# EAGLE board motoretc... (EAGLE 8.0.1), part 1 of 3
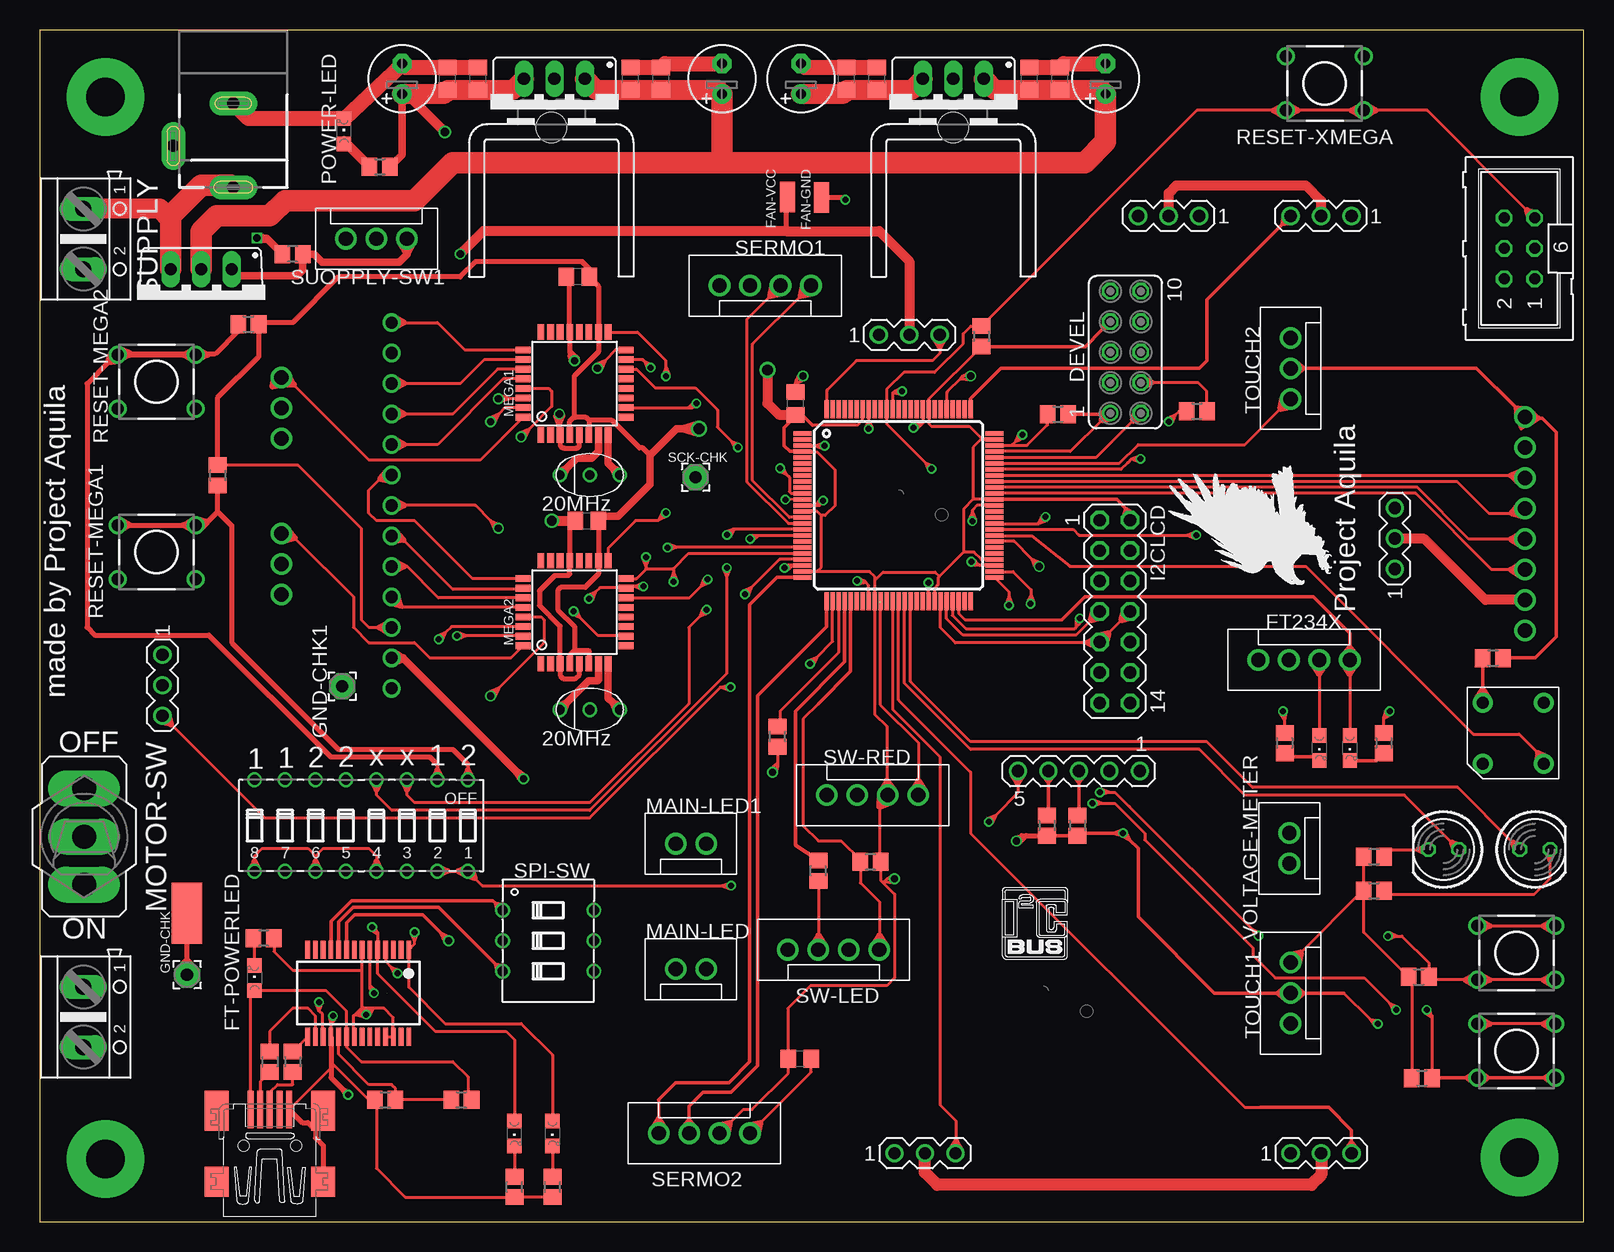
[diagram p5: board, top side]
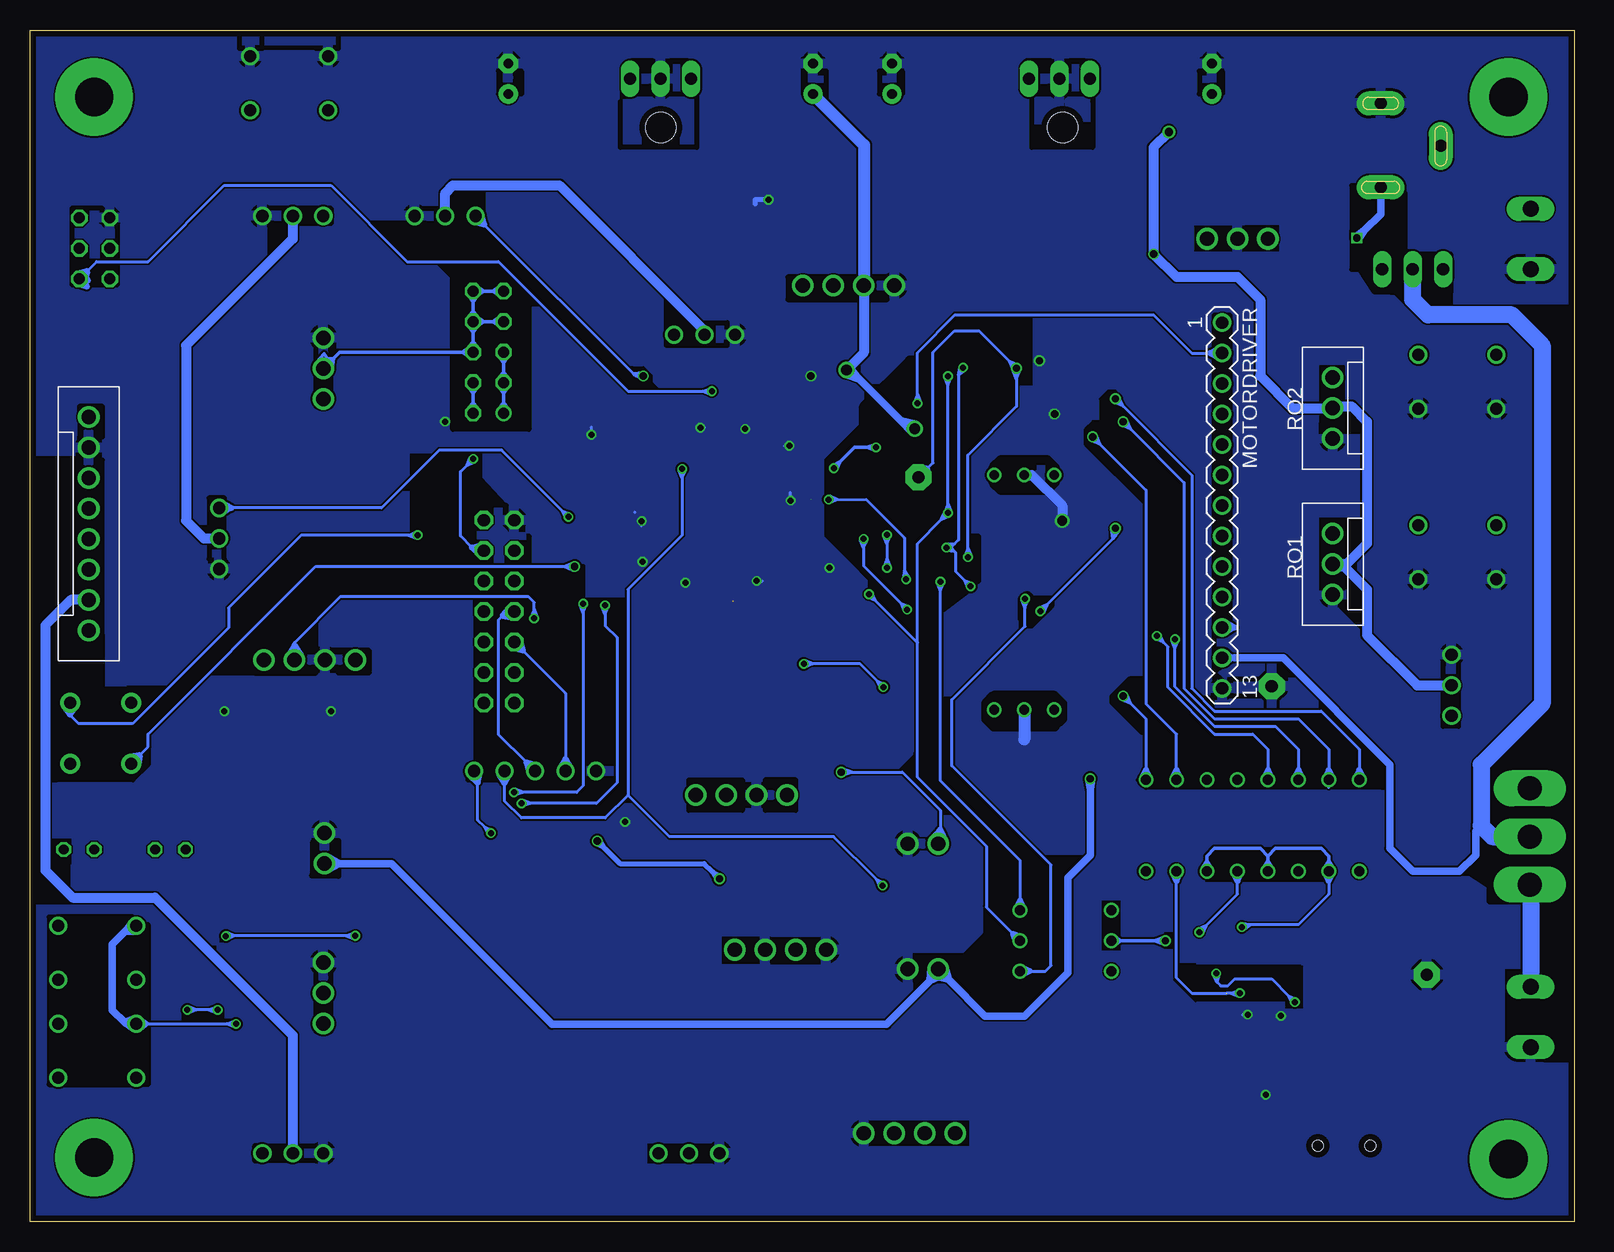
[diagram p6: board, bottom side, seen from below]

Size 128.72 x 99.31 mm. Coordinates in mm from the lower left corner, seen from the top.
Outline: 0,0 128.72,0 128.72,99.31 0,99.31 0,0
Copper layers (1*16): Top 0.035mm / dielectric 1.6mm / Bottom 0.035mm
Design rules "Elecrow_2-layer_PCB_eagle_rule": minimum track width 6mil, minimum drill 12mil, track to track 6mil, track to pad 6mil, pad to pad 6mil, via to via 8mil, smd to smd 0mil, copper to edge 20mil, drill to drill 10mil, minimum pad ring 6mil, minimum via ring 6mil, stop-mask expansion 0mil, vias tented up to drill 100mil, thermal gap 10mil
bRestrict: area 80.1,38.3 to 82.3,48.6; area 82.7,38.4 to 86.8,51.5; area 79.3,48.7 to 86.9,52; area -0.6,14.3 to 4.7,18.5; area -1.2,13.3 to 2.5,14.6; area 4.4,15.1 to 5.7,21.1; area 17.5,50.5 to 18.9,53.1; area 124.5,53.1 to 129.2,63.8; area 122.5,44.9 to 127.9,48.9; area 116.7,43.1 to 120.7,44.7; area 125.3,29.8 to 127.1,31.9; area 125.3,26.5 to 128.6,27; 29 more areas; 232 lines

## Footprints (pad centres in the part's own frame; a part is rotated, then mirrored left to right if it is on the bottom)
E2,5-6 = drill 0.813 pad 1.6: + -1.27,0 | drill 0.813 pad 1.6 octagon: - 1.27,0
C0805 = smd 1.3 x 1.5: 1 -0.95,0; 2 0.95,0
78XXS = drill 1.016 long: GND 0,-2.54; IN -2.54,-2.54; OUT 2.54,-2.54
OSTA71A1D-A = drill 1 pad 1.676: ANODE 2.54,2.54; BLUE 2.54,-2.54; GREEN -2.54,-2.54; RED -2.54,2.54
CON8 = drill 1.2: P$1 -8.89,0; P$2 -6.35,0; P$3 -3.81,0; P$4 -1.27,0; P$5 1.27,0; P$6 3.81,0; P$7 6.35,0; P$8 8.89,0
FE05-2 = drill 0.914: 1 -5.08,1.27 | drill 0.914 octagon: 2 -5.08,-1.27; 3 -2.54,1.27; 4 -2.54,-1.27; 5 0,1.27; 6 0,-1.27; 7 2.54,1.27; 8 2.54,-1.27; 9 5.08,1.27; 10 5.08,-1.27
R0805 = smd 1.3 x 1.5: 1 -0.85,0; 2 0.85,0
SMD1,27-2,54 = smd 1.27 x 2.54: 1 0,0
32005-201 = smd 3.1 x 0.5: 1 3,1.6; 2 3,0.8; 3 3,0; 4 3,-0.8; 5 3,-1.6 | smd 2.5 x 2: M1 -3,-4.45; M2 -3,4.45 | smd 3.3 x 2: M3 2.9,4.45; M4 2.9,-4.45 | hole 0.9: 0,2.2; 0,-2.2
CON4 = drill 1.2: P$1 -3.81,0; P$2 -1.27,0; P$3 1.27,0; P$4 3.81,0
CHIPLED_0805 = smd 1.2 x 1.2: A 0,-1.05; C 0,1.05
2,15/1,0 = drill 1.016 pad 2.159 octagon: 1 0,0
MA07-2 = drill 1.016 octagon: 1 -7.62,-1.27; 2 -7.62,1.27; 3 -5.08,-1.27; 4 -5.08,1.27; 5 -2.54,-1.27; 6 -2.54,1.27; 7 0,-1.27; 8 0,1.27; 9 2.54,-1.27; 10 2.54,1.27; 11 5.08,-1.27; 12 5.08,1.27; 13 7.62,-1.27; 14 7.62,1.27
SSOP28 = smd 0.4 x 1.5: 1 -4.225,-3.625; 2 -3.575,-3.625; 3 -2.925,-3.625; 4 -2.275,-3.625; 5 -1.625,-3.625; 6 -0.975,-3.625; 7 -0.325,-3.625; 8 0.325,-3.625; 9 0.975,-3.625; 10 1.625,-3.625; 11 2.275,-3.625; 12 2.925,-3.625; 13 3.575,-3.625; 14 4.225,-3.625; 15 4.225,3.625; 16 3.575,3.625; 17 2.925,3.625; 18 2.275,3.625; 19 1.625,3.625; 20 0.975,3.625; 21 0.325,3.625; 22 -0.325,3.625; 23 -0.975,3.625; 24 -1.625,3.625; 25 -2.275,3.625; 26 -2.925,3.625; 27 -3.575,3.625; 28 -4.225,3.625
D01PA = hole 2.54: 0,-1.016
LED5MM = drill 0.813 octagon: A -1.27,0; K 1.27,0
MA05-1 = drill 1.016: 1 -5.08,0; 2 -2.54,0; 3 0,0; 4 2.54,0; 5 5.08,0
CON2 = drill 1.2: P$1 -1.27,0; P$2 1.27,0
TQFP32-08 = smd 1.27 x 0.559: 1 -4.293,2.8; 2 -4.293,2; 3 -4.293,1.2; 4 -4.293,0.4; 5 -4.293,-0.4; 6 -4.293,-1.2; 7 -4.293,-2; 8 -4.293,-2.8; 17 4.293,-2.8; 18 4.293,-2; 19 4.293,-1.2; 20 4.293,-0.4; 21 4.293,0.4; 22 4.293,1.2; 23 4.293,2; 24 4.293,2.8 | smd 0.559 x 1.27: 9 -2.8,-4.293; 10 -2,-4.293; 11 -1.2,-4.293; 12 -0.4,-4.293; 13 0.4,-4.293; 14 1.2,-4.293; 15 2,-4.293; 16 2.8,-4.293; 25 2.8,4.293; 26 2,4.293; 27 1.2,4.293; 28 0.4,4.293; 29 -0.4,4.293; 30 -1.2,4.293; 31 -2,4.293; 32 -2.8,4.293
AK500/2 = drill 1.321 long: 1 -2.515,0; 2 2.515,0
320-916 = drill 2.007 long: 1 0,4.013; 2 0,0; 3 0,-4.013
MA13-1 = drill 1.016: 1 -15.24,0; 2 -12.7,0; 3 -10.16,0; 4 -7.62,0; 5 -5.08,0; 6 -2.54,0; 7 0,0; 8 2.54,0; 9 5.08,0; 10 7.62,0; 11 10.16,0; 12 12.7,0; 13 15.24,0
SMD2,54-5,08 = smd 2.54 x 5.08: 1 0,0
CSTLS_X = drill 0.813: 1 -2.5,0; 2 0,0; 3 2.5,0
TO220BV = drill 1.016 long: D 0,-2.54; G -2.54,-2.54; S 2.54,-2.54
DTS-6 = drill 1: 1 -3.25,2.25; 2 3.25,2.25; 3 -3.25,-2.25; 4 3.25,-2.25
CON3 = drill 1.2: P$1 -2.54,0; P$2 0,0; P$3 2.54,0
DIP08S = drill 0.813: 1 -8.89,-3.81; 2 -6.35,-3.81; 3 -3.81,-3.81; 4 -1.27,-3.81; 5 1.27,-3.81; 6 3.81,-3.81; 7 6.35,-3.81; 8 8.89,-3.81; 9 8.89,3.81; 10 6.35,3.81; 11 3.81,3.81; 12 1.27,3.81; 13 -1.27,3.81; 14 -3.81,3.81; 15 -6.35,3.81; 16 -8.89,3.81
DIP03YL = drill 0.813: 1 -2.54,-3.81; 2 0,-3.81; 3 2.54,-3.81; 4 2.54,3.81; 5 0,3.81; 6 -2.54,3.81
MA03-1 = drill 1.016: 1 -2.54,0; 2 0,0; 3 2.54,0
ML6 = drill 0.914 octagon: 1 -2.54,-1.27; 2 -2.54,1.27; 3 0,-1.27; 4 0,1.27; 5 2.54,-1.27; 6 2.54,1.27
TQFP-100A-100 = smd 1.5 x 0.35: 1 -8,6; 2 -8,5.5; 3 -8,5; 4 -8,4.5; 5 -8,4; 6 -8,3.5; 7 -8,3; 8 -8,2.5; 9 -8,2; 10 -8,1.5; 11 -8,1; 12 -8,0.5; 13 -8,0; 14 -8,-0.5; 15 -8,-1; 16 -8,-1.5; 17 -8,-2; 18 -8,-2.5; 19 -8,-3; 20 -8,-3.5; 21 -8,-4; 22 -8,-4.5; 23 -8,-5; 24 -8,-5.5; 25 -8,-6; 51 8,-6; 52 8,-5.5; 53 8,-5; 54 8,-4.5; 55 8,-4; 56 8,-3.5; 57 8,-3; 58 8,-2.5; 59 8,-2; 60 8,-1.5; 61 8,-1; 62 8,-0.5; 63 8,0; 64 8,0.5; 65 8,1; 66 8,1.5; 67 8,2; 68 8,2.5; 69 8,3; 70 8,3.5; 71 8,4; 72 8,4.5; 73 8,5; 74 8,5.5; 75 8,6 | smd 0.35 x 1.5: 26 -6,-8; 27 -5.5,-8; 28 -5,-8; 29 -4.5,-8; 30 -4,-8; 31 -3.5,-8; 32 -3,-8; 33 -2.5,-8; 34 -2,-8; 35 -1.5,-8; 36 -1,-8; 37 -0.5,-8; 38 0,-8; 39 0.5,-8; 40 1,-8; 41 1.5,-8; 42 2,-8; 43 2.5,-8; 44 3,-8; 45 3.5,-8; 46 4,-8; 47 4.5,-8; 48 5,-8; 49 5.5,-8; 50 6,-8; 76 6,8; 77 5.5,8; 78 5,8; 79 4.5,8; 80 4,8; 81 3.5,8; 82 3,8; 83 2.5,8; 84 2,8; 85 1.5,8; 86 1,8; 87 0.5,8; 88 0,8; 89 -0.5,8; 90 -1,8; 91 -1.5,8; 92 -2,8; 93 -2.5,8; 94 -3,8; 95 -3.5,8; 96 -4,8; 97 -4.5,8; 98 -5,8; 99 -5.5,8; 100 -6,8
MJ-179P = drill 1 pad 2 long: 1 3,0; 2 -4,0; 3 -0.45,-5

## Placement (x,y rotation side)
3.3C1  100u  [E2,5-6]  88.85,95.25 90 top
3.3C2  0.1u  [C0805]  85.04,95.25 90 top
3.3C3  0.1u  [C0805]  82.5,95.25 90 top
3.3C4  0.1u  [C0805]  69.8,95.25 90 top
3.3C5  0.1u  [C0805]  67.26,95.25 90 top
3.3C6  100u  [E2,5-6]  63.45,95.25 90 top
3.3V-REGU  [78XXS]  76.15,92.71 180 top
5C11  100u  [E2,5-6]  56.87,95.25 90 top
5C12  0.1u  [C0805]  51.79,95.25 90 top
5C13  0.1u  [C0805]  49.25,95.25 90 top
5C14  0.1u  [C0805]  36.55,95.25 90 top
5C15  0.1u  [C0805]  34.01,95.25 90 top
5C16  100u  [E2,5-6]  30.2,95.25 90 top
5V-REGU  [78XXS]  42.9,92.71 180 top
CHECKLED  OSTA71A1D-A  [OSTA71A1D-A]  122.83,40.72 90 top
CN2  COLOR-XH-M  [CON8]  123.82,58.16 270 bottom
DEVEL  [FE05-2]  90.51,72.47 90 top
DEVEL-R1  4.7K  [R0805]  84.87,67.28 0 top
DEVEL-R2  4.7K  [R0805]  96.46,67.55 0 top
ERROR1-R  330  [R0805]  111.22,27.59 0 top
ERROR2-R  330  [R0805]  111.22,30.43 0 top
FAN-GND  [SMD1,27-2,54]  65.16,85.36 180 top
FAN-VCC  [SMD1,27-2,54]  62.33,85.39 0 top
FT232-R1  4.7K  [R0805]  35.15,10.16 0 top
FT232-R2  10K  [R0805]  28.8,10.16 0 top
FT232-R3  1K  [R0805]  18.67,23.62 180 top
FT232-R4  330  [R0805]  39.56,2.9 90 top
FT232-R5  330  [R0805]  42.74,2.9 90 top
FT232-R6  23  [R0805]  21.08,13.34 270 top
FT232-R7  23  [R0805]  19.18,13.34 270 top
FT232USBCON  Wrie-USB  [32005-201]  19.18,6.35 90 top
FT234-R1  330  [R0805]  103.78,39.9 270 top
FT234-R2  330  [R0805]  112.03,39.9 270 top
FT234X  XH-4  [CON4]  105.39,46.83 180 top
FT-POWERLED  [CHIPLED_0805]  17.91,20.32 0 top
GND-CHK  [2,15/1,0]  12.27,20.59 0 top
GND-CHK1  [2,15/1,0]  25.21,44.62 0 top
I2CLCD  [MA07-2]  89.62,50.85 270 top
IC5  FT232RL  [SSOP28]  26.54,19.05 180 top
KK1  D01PA  [D01PA]  76.15,90.19 180 top
KK2  D01PA  [D01PA]  42.64,90.19 180 top
L1  RXDLED  [CHIPLED_0805]  39.56,7.35 180 top
L2  TXDLED  [CHIPLED_0805]  42.74,7.35 180 top
L3  E1  [LED5MM]  124.64,31.02 0 top
L4  E2  [LED5MM]  117.02,31.02 180 top
LCD-I2C  LCD-I2C  [MA05-1]  86.62,37.56 180 top
LED-R1  330  [R0805]  61.5,40.44 90 top
M1-R1  4.7K  [R0805]  14.84,62.2 90 top
M2-R1  4.7K  [R0805]  17.4,74.8 0 top
M2-R2  4.7K  [R0805]  21.08,80.64 180 top
MAIN-LED  XH-2  [CON2]  54.28,21.05 0 top
MAIN-LED1  XH-2  [CON2]  54.28,31.5 0 top
MEGA1  [TQFP32-08]  44.58,69.85 90 top
MEGA1-C1  0.1u  [C0805]  45.59,58.42 0 top
MEGA2  [TQFP32-08]  44.58,50.8 90 top
MEGA2-C1  0.1u  [C0805]  44.85,78.74 180 top
MOTOR-SUPPLY  MOTOR  [AK500/2]  3.63,17.07 270 top
MOTOR-SW  [320-916]  3.7,32.1 0 top
MOTORDRIVER  [MA13-1]  29.34,59.69 270 bottom
PAD2  [SMD2,54-5,08]  12.29,25.7 0 top
POWER-LED  [CHIPLED_0805]  25.36,90.87 0 top
POWER-LEDR  1K  [R0805]  28.34,87.92 0 top
Q1  20MHz  [CSTLS_X]  45.85,62.23 0 top
Q2  20MHz  [CSTLS_X]  45.85,42.67 0 top
Q3  IRF9530  [TO220BV]  13.46,76.83 180 top
R150  330  [R0805]  121.13,46.98 0 top
RESET-MEGA1  R-1  [DTS-6]  9.73,55.8 0 top
RESET-MEGA2  R-2  [DTS-6]  9.73,70 0 top
RESET-XMEGA  DTS-6  [DTS-6]  107.11,94.86 180 top
RO1  XH-3  [CON3]  20.13,54.8 90 bottom
RO2  XH-3  [CON3]  20.13,67.8 90 bottom
RXD-LED1  RXDLED  [CHIPLED_0805]  109.2,39.48 180 top
S1  [DIP08S]  26.8,33.02 180 top
SCK-CHK  [2,15/1,0]  54.67,62.05 0 top
SERMO  0.1u  [C0805]  63.36,13.57 180 top
SERMO1  XH-4  [CON4]  60.48,78.01 0 top
SERMO2  XH-4  [CON4]  55.4,7.38 180 top
SPI-SW  [DIP03YL]  42.39,23.42 270 top
SUOPPLY-SW1  XH-3  [CON3]  28.07,81.92 180 top
SUPPLY  MAIN  [AK500/2]  3.63,81.9 270 top
SV1  Range1  [MA03-1]  112.95,56.94 90 top
SV2  Range2  [MA03-1]  106.81,83.82 180 top
SV3  [ML6]  123.34,81.11 90 top
SV4  Range3  [MA03-1]  94.11,83.82 180 top
SV5  Range4  [MA03-1]  10.22,44.71 270 top
SV6  Range5  [MA03-1]  73.79,5.71 0 top
SV7  Range6  [MA03-1]  106.81,5.71 0 top
SV8  Servo  [MA03-1]  72.48,73.91 0 top
SW-LED  XH-4  [CON4]  66.17,22.67 0 top
SW-R1  330  [R0805]  64.9,29.26 90 top
SW-R2  4.7K  [R0805]  69.25,29.99 180 top
SW-R3  4.7K  [R0805]  86.49,33.02 270 top
SW-R4  4.7K  [R0805]  83.95,33.02 270 top
SW-RED  XH-4  [CON4]  69.42,35.56 180 top
TESTSW-R1  4.7K  [R0805]  114.94,20.4 0 top
TESTSW-R2  4.7K  [R0805]  115.21,11.97 0 top
TOUCH1  XH-3  [CON3]  104.27,19.05 90 top
TOUCH2  XH-3  [CON3]  104.27,71.12 90 top
TXD-LED1  TXDLED  [CHIPLED_0805]  106.66,39.48 180 top
U1  [TQFP-100A-100]  71.6,59.69 0 top
U$2  [I2C]  80.24,21.86 0 top
U$3  [LOGO]  79.86,17.05 0 top
U$4  [EAGLE-PLC-10MM]  107.7,53.06 90 top
VOLTAGE-METER  XH-2  [CON2]  104.17,31.11 90 top
X1  DCJACK-MJ179P  [MJ-179P]  16.13,89.2 270 top
X-R1  4.7K  [R0805]  78.49,73.79 270 top
XMEGA-C1  0.1u  [C0805]  63.01,68.18 90 top
XMEGA-TEST1  SW1  [DTS-6]  123.1,22.4 0 top
XMEGA-TEST2  SW2  [DTS-6]  123.1,14.24 0 top

## Tracks (layer width: path | path; a pad name or v marks a point on that pad's centre or on a via)
+3V3  (via drill 0.5, 0.6, 0.9)
  Top 0.254: MEGA1-C1.2 arc-90 46.58,58.39 | XMEGA-TEST2.2 125.35,16.49 120.85,16.49 XMEGA-TEST2.1 | XMEGA-TEST1.1 120.85,24.65 125.35,24.65 XMEGA-TEST1.2 | 45.85,78.79 MEGA2-C1.1 45.8,79.42 | M1-R1.2 21.53,63.05 26.8,57.78 26.8,50.16 27.43,49.53 28.32,49.53 MOTORDRIVER.11 | 45.85,65.63 MEGA1.6 | 44.18,47.23 MEGA2.4 | MEGA2.18 46.48,55 | SW-R2.1 70.1,28.45 70.3,28.26 | 70.3,28.26 71.25,27.3 71.25,20.32 70.61,19.68 64.26,19.68 62.36,17.78 62.36,13.62 SERMO.2 62.41,12.39 59.38,9.37 58.65,9.37 57.52,8.23 SERMO2.P$2 | X-R1.2 74.1,68.55 U1.83 74.1,66.51 74.34,66.28 77.49,66.28 78.57,65.19 U1.74 78.46,65.19 77.8,64.53 77.8,60.19 | v71.25,28.57 70.61,28.57 70.38,28.34 | 70.38,28.34 70.3,28.26 | 70.61,29.84 69.98,30.48 69.98,34.6 69.98,34.84 SW-RED.P$2 70.61,35.64 70.61,36.76 70.61,41.27 69.6,42.29 U1.34 69.61,51.7 69.61,53.44 | 70.38,28.34 71.21,28.25 | 71.21,28.25 | 64.41,66.38 68.16,66.38 68.6,66.82 U1.94 | U1.54 78.5,55.19 77.88,55.8 77,55.8 | 77,55.8 74.98,53.79 | 74.98,53.79 74.89,53.7 74.89,53.07 74.6,52.77 U1.44 | U1.64 77.8,60.19 | 77.8,60.19 77,59.39 77,55.8 | 69.61,53.44 70.3,54.13 74.64,54.13 74.98,53.79 | 69.61,53.44 69.61,53.75 69.18,54.18 63.61,54.18 U1.24 64.78,54.19 65.14,54.55 65.14,58.83 | 65.14,58.83 64.79,59.19 U1.14 | U1.4 63.62,64.17 64.8,64.17 | 64.8,64.17 66.29,62.67 66.29,59.68 65.47,58.86 65.14,58.86 65.14,58.83 | 64.8,64.17 64.79,64.16 | 63.01,67.12 XMEGA-C1.1 | v111.54,16.49 111.27,16.49 110.89,16.87 | 110.89,16.87 108.71,19.05 | 70.38,28.34 | 70.38,28.34 71.21,28.25 | v71.25,28.57 71.21,28.25 | 70.38,28.34 71.05,28.84 | v71.25,28.57 71.05,28.84 | 71.21,28.25 | 70.38,28.34 71.21,28.25
  Top 0.254: v71.25,28.57 71.21,28.25 | 70.38,28.34 71.05,28.84 v71.25,28.57 | 70.38,28.34 71.21,28.25 | 70.38,28.34 71.05,28.84 | 70.38,28.34 71.21,28.25 | v71.25,28.57 71.21,28.25 | 70.38,28.34 71.05,28.84 | v71.25,28.57 71.05,28.84 | 110.89,16.87 111.33,16.32 v111.54,16.49 | 110.89,16.87 111.58,16.76 v111.54,16.49
  Top 0.305: 108.71,19.05 105.47,19.05 | 105.47,19.05 | 105.47,19.05 TOUCH1.P$2 | 70.61,29.84 70.24,29.84 SW-R2.1 | TOUCH2.P$2 105.47,71.12 | 105.47,71.12 | 105.47,71.12 119.76,71.12 122.98,67.9 | 122.98,67.9 | 122.98,67.9 CN2.P$1 | v90.3,32.38 89.55,32.38 | 89.55,32.38 86.7,32.38 SW-R3.2 SW-R4.2 | DEVEL.7 88.59,74.36 | 88.59,74.36 87.17,72.94 X-R1.2 | I2CLCD.2 90.93,58.52 90.93,59.05 90.56,59.43 | 90.56,59.43 89.8,60.19 U1.64 | TOUCH1.P$2 103.07,19.05 | 103.07,19.05 | 103.07,19.05 97.92,19.05 91.57,25.4 91.57,31.11 90.83,31.86 | 90.83,31.86 v90.3,32.38 | 122.98,67.9 | 122.98,67.9 123.91,67.8 | 18.38,74.93 M2-R1.2 | 105.47,71.12 104.73,71.7 | 103.07,19.05 | 103.07,19.05 103.8,19.64 | 105.47,19.05 104.73,19.64 | 103.07,19.05 103.8,19.64 | 122.98,67.9 123.08,66.97 | 123.08,66.97 | 122.98,67.9 | 123.08,66.97 125.02,66.97 | 125.02,66.97 125.23,66.97 126.43,65.77 126.43,48.77 124.64,46.98 R150.2 | 63.01,67.12 62.05,66.16 62.05,64.67 62.52,64.19 U1.4 | 64.41,66.38 63.55,67.23 | 89.55,32.38 90.21,32.15 v90.3,32.38 | 89.55,32.38 90.21,32.62 v90.3,32.38 | 90.83,31.86 90.52,32.49 v90.3,32.38 | 90.83,31.86 90.19,32.16 v90.3,32.38 | 105.47,71.12 | 105.47,71.12 104.73,71.7 | 105.47,71.12 | 105.47,71.12 104.73,70.53 | 105.47,71.12 104.73,71.7 | 104.73,71.7 | TOUCH2.P$2 104.73,71.7 | 105.47,71.12 104.73,70.53 | 105.47,71.12 104.73,71.7 | TOUCH2.P$2 104.73,71.7 | 105.47,71.12 104.73,70.53 | 104.73,70.53 | 104.73,70.53 | TOUCH2.P$2 104.73,70.53 | 105.47,71.12 104.73,71.7 | 105.47,71.12 104.73,70.53 | 105.47,71.12 104.73,71.7 | 105.47,71.12 | 105.47,71.12 104.73,70.53 | TOUCH2.P$2 104.73,70.53 | 105.47,71.12 104.73,71.7 | TOUCH2.P$2 104.73,71.7 | 105.47,71.12 104.73,70.53 | TOUCH2.P$2 104.73,70.53
  Top 0.305: 105.47,19.05 | 105.47,19.05 104.73,19.64 | 105.47,19.05 | 105.47,19.05 104.73,18.46 | 105.47,19.05 104.73,19.64 | 104.73,19.64 | TOUCH1.P$2 104.73,19.64 | 105.47,19.05 104.73,18.46 | 103.07,19.05 103.8,18.46 | 103.07,19.05 103.8,19.64 | 103.8,19.64 | TOUCH1.P$2 103.8,19.64 | 103.8,18.46 | 105.47,19.05 104.73,19.64 | TOUCH1.P$2 104.73,19.64 | 105.47,19.05 104.73,18.46 | 104.73,18.46 | 104.73,18.46 | TOUCH1.P$2 104.73,18.46 | 105.47,19.05 104.73,19.64 | 105.47,19.05 104.73,18.46 | 105.47,19.05 104.73,19.64 | 105.47,19.05 | 105.47,19.05 104.73,18.46 | TOUCH1.P$2 104.73,18.46 | 105.47,19.05 104.73,19.64 | TOUCH1.P$2 104.73,19.64 | 105.47,19.05 104.73,18.46 | TOUCH1.P$2 104.73,18.46 | 103.07,19.05 | 103.07,19.05 103.8,18.46 | 103.07,19.05 103.8,19.64 | 103.07,19.05 | 103.07,19.05 103.8,18.46 | TOUCH1.P$2 103.8,18.46 | 103.07,19.05 103.8,19.64 | 103.07,19.05 103.8,18.46 | 103.8,18.46 | TOUCH1.P$2 103.8,18.46 | 103.07,19.05 103.8,19.64 | TOUCH1.P$2 103.8,19.64 | 103.07,19.05 103.8,18.46 | TOUCH1.P$2 103.8,18.46 | 103.07,19.05 103.8,19.64 | TOUCH1.P$2 103.8,19.64 | CN2.P$1 124.3,66.61 123.51,66.09 123.18,66.97 CN2.P$1 | 122.98,67.9 123.08,66.97 | CN2.P$1 123.08,66.97 | 122.98,67.9 123.91,67.8 | 123.91,67.8 | CN2.P$1 123.91,67.8 | 122.98,67.9 123.08,66.97 | CN2.P$1 123.08,66.97 | 122.98,67.9 123.91,67.8 | CN2.P$1 123.91,67.8 | 125.02,66.97 124.33,67.61 CN2.P$1 | 125.02,66.97 124.25,66.44 CN2.P$1 | 90.56,59.43 90.31,58.66 I2CLCD.2 | 90.56,59.43 91.23,58.98 I2CLCD.2 | 88.59,74.36 | 88.59,74.36 89.32,74.48 | 89.32,74.48 | 88.59,74.36 | 88.59,74.36 88.71,75.1 | 88.71,75.1 | 88.59,74.36 89.32,74.48 | 88.59,74.36 88.71,75.1 | 88.59,74.36 89.32,74.48 | DEVEL.7 89.32,74.48 | 88.59,74.36 88.71,75.1
  Top 0.305: DEVEL.7 88.71,75.1
  Top 0.406: MEGA2-C1.1 46.58,77.96 MEGA1.18 46.58,72.48 44.58,70.48 44.58,67.11 | 46.58,58.39 MEGA2.18 46.58,53.99 45.47,52.88 43.43,52.88 43.17,52.62 43.17,51.02 44.58,49.62 44.58,47.62 | 44.58,47.62 44.18,47.23 | 63.55,67.23 XMEGA-C1.1 | M1-R1.2 14.84,68.69 18.25,72.1 M2-R1.2 | 18.38,74.93 21.08,74.93 24.89,78.74 35.05,78.74 36.32,80.01 45.21,80.01 45.8,79.42 | v81.42,31.73 81.86,32.17 82.2,32.17 | 82.2,32.17 SW-R4.2 | MEGA2.6 45.78,47.58 45.73,47.62 44.58,47.62 | MEGA1.4 44.18,66.71 44.58,67.11 | 45.78,66.79 MEGA1.6 | 45.78,66.79 45.53,67.04 44.65,67.04 44.58,67.11 | 50.88,63.87 50.25,64.5 49.99,64.5 47.7,66.79 45.78,66.79 | 82.2,32.17 81.36,31.97 v81.42,31.73 | 82.2,32.17 81.6,31.56 v81.42,31.73
  Top 0.508: 29.08,49.97 | 120.09,25.08 | 120.09,16.92 | 28.32,49.53 | 28.32,49.53 | 28.32,49.53 | 29.08,49.09 | 29.08,49.09 | 28.32,49.53 29.08,49.09 | MOTORDRIVER.11 29.08,49.09 | 28.32,49.53 29.08,49.97 | 29.08,49.97 | 29.08,49.97 | MOTORDRIVER.11 29.08,49.97 | 120.85,24.65 | 120.85,24.65 120.09,25.08 | 120.85,24.65 | 120.85,24.65 120.09,25.08 | 120.09,25.08 | XMEGA-TEST1.1 120.09,25.08 | 120.85,24.65 120.09,24.22 | 120.85,16.49 | 120.85,16.49 120.09,16.92 | 120.85,16.49 | 120.85,16.49 120.09,16.92 | 120.09,16.92 | XMEGA-TEST2.1 120.09,16.92 | 120.85,16.49 120.09,16.06 | 125.35,16.49 | 125.35,16.49 126.1,16.92 | 125.35,16.49 126.1,16.06 | 125.35,16.49 126.1,16.92 | 126.1,16.92 | XMEGA-TEST2.2 126.1,16.92 | 125.35,24.65 | 125.35,24.65 126.1,25.08 | 125.35,24.65 126.1,24.22 | 125.35,24.65 126.1,25.08 | 126.1,25.08 | XMEGA-TEST1.2 126.1,25.08 | 28.32,49.53 29.08,49.09 | 29.08,49.09 | 29.08,49.09 | 28.32,49.53 | 28.32,49.53 29.08,49.09 | MOTORDRIVER.11 29.08,49.09 | 28.32,49.53 29.08,49.97 | 29.08,49.97 | MOTORDRIVER.11 29.08,49.97 | 28.32,49.53 | 28.32,49.53 29.08,49.09 | MOTORDRIVER.11 29.08,49.09 | 28.32,49.53 29.08,49.97 | MOTORDRIVER.11 29.08,49.97 | 28.32,49.53 29.08,49.09 | 28.32,49.53 29.08,49.97 | 28.32,49.53 29.08,49.09 | MOTORDRIVER.11 29.08,49.09 | 28.32,49.53 29.08,49.97 | MOTORDRIVER.11 29.08,49.97 | SW-RED.P$2 70.92,34.96 69.98,34.6 70.05,35.6 SW-RED.P$2 | SW-RED.P$2 70.13,35.87 70.61,36.76 71.21,35.94 SW-RED.P$2 | 120.85,24.65 120.09,25.08 | 120.09,25.08 | 120.09,24.22 | 120.85,24.65 120.09,25.08 | 120.09,25.08 | 120.85,24.65 | 120.09,24.22 | XMEGA-TEST1.1 120.09,24.22 | 120.85,24.65 120.09,25.08 | 120.09,25.08 | 120.85,24.65 | 120.85,24.65 120.09,24.22 | XMEGA-TEST1.1 120.09,24.22 | 120.85,24.65 120.09,25.08
  Top 0.508: XMEGA-TEST1.1 120.09,25.08 | 120.85,24.65 120.09,24.22 | XMEGA-TEST1.1 120.09,24.22 | 120.85,16.49 120.09,16.92 | 120.09,16.92 | 120.09,16.06 | 120.85,16.49 120.09,16.92 | 120.09,16.92 | 120.85,16.49 | 120.09,16.06 | XMEGA-TEST2.1 120.09,16.06 | 120.85,16.49 120.09,16.92 | 120.09,16.92 | 120.85,16.49 | 120.85,16.49 120.09,16.06 | XMEGA-TEST2.1 120.09,16.06 | 120.85,16.49 120.09,16.92 | XMEGA-TEST2.1 120.09,16.92 | 120.85,16.49 120.09,16.06 | XMEGA-TEST2.1 120.09,16.06 | 125.35,16.49 126.1,16.06 | 126.1,16.06 | 125.35,16.49 126.1,16.06 | 126.1,16.06 | 125.35,16.49 | 125.35,16.49 126.1,16.06 | XMEGA-TEST2.2 126.1,16.06 | 125.35,16.49 126.1,16.92 | 126.1,16.92 | 126.1,16.92 | 125.35,16.49 | 125.35,16.49 126.1,16.06 | XMEGA-TEST2.2 126.1,16.06 | 125.35,16.49 | 125.35,16.49 126.1,16.92 | 126.1,16.92 | 125.35,16.49 126.1,16.06 | 125.35,16.49 126.1,16.92 | 125.35,16.49 126.1,16.06 | XMEGA-TEST2.2 126.1,16.06 | 125.35,16.49 126.1,16.92 | XMEGA-TEST2.2 126.1,16.92 | 125.35,24.65 126.1,24.22 | 126.1,24.22 | 125.35,24.65 126.1,24.22 | 126.1,24.22 | 125.35,24.65 | 125.35,24.65 126.1,24.22 | XMEGA-TEST1.2 126.1,24.22 | 125.35,24.65 126.1,25.08 | 126.1,25.08 | 126.1,25.08 | 125.35,24.65 | 125.35,24.65 126.1,24.22 | XMEGA-TEST1.2 126.1,24.22 | 125.35,24.65 | 125.35,24.65 126.1,25.08 | 126.1,25.08 | 125.35,24.65 126.1,24.22 | 125.35,24.65 126.1,25.08 | 125.35,24.65 126.1,24.22 | XMEGA-TEST1.2 126.1,24.22 | 125.35,24.65 126.1,25.08 | XMEGA-TEST1.2 126.1,25.08 | 57.52,8.23 56.53,8.01 SERMO2.P$2 57.3,7.24 57.52,8.23
  Top 0.61: MEGA1-C1.2 46.9,58.78 48.21,58.78 50.88,61.44 50.88,63.87 53.09,66.08 53.61,66.08 | v54.96,66.08 53.61,66.08 | 53.61,66.08 54.86,65.73 v54.96,66.08 | 53.61,66.08 54.86,66.44 v54.96,66.08
  Top 0.813: v60.66,70.99 60.66,68.2 61.6,67.26 62.98,67.26 XMEGA-C1.1
  Top 1.676: 3.3V-REGU.OUT 72.66,94.3 3.3C4.1 3.3C5.1 66.94,93.98 3.3C6.+
  Bottom 0.254: 28.32,49.53 MOTORDRIVER.11 | v90.3,32.38 90.83,32.91 | 90.83,32.91 91.39,33.47 91.39,36.59 91.39,36.96 91.7,37.27 LCD-I2C.1 | 118.85,16.51 112.29,16.51 | 112.29,16.51 111.56,16.51 v111.54,16.49 | 59.21,77.44 SERMO1.P$2 | 90.83,32.91 90.19,32.64 v90.3,32.38 | 90.83,32.91 90.55,32.27 v90.3,32.38 | 112.29,16.51 111.64,16.75 v111.54,16.49 | 112.29,16.51 111.65,16.24 v111.54,16.49
  Bottom 0.305: XMEGA-TEST2.1 119.83,16.51 118.85,16.51 | DEVEL.6 92.69,72.47 | 92.69,72.47 | 92.69,72.47 102.92,72.47 103.42,71.97 | 103.42,71.97 | 103.42,71.97 TOUCH2.P$2 | DEVEL.9 90.15,77.55 | 90.15,77.55 | 90.15,77.55 90.86,77.55 | 90.86,77.55 | 90.86,77.55 DEVEL.10 | DEVEL.10 91.78,76.64 | 91.78,76.64 | 91.78,76.64 91.78,75.92 | 91.78,75.92 | 91.78,75.92 DEVEL.8 | DEVEL.8 91.78,74.1 | 91.78,74.1 | 91.78,74.1 91.78,73.38 | 91.78,73.38 | 91.78,73.38 DEVEL.6 | DEVEL.7 90.15,75.01 | 90.15,75.01 | 90.15,75.01 90.86,75.01 | 90.86,75.01 | 90.86,75.01 DEVEL.8 | 103.42,71.97 | 103.42,71.97 104.35,71.86 | 91.78,73.38 91.35,72.78 | 91.78,75.92 91.35,75.32 | 90.86,75.01 91.47,74.58 | 90.86,77.55 91.47,77.12 | 90.15,77.55 89.55,77.12 | 91.78,73.38 | 91.78,73.38 92.21,72.78 | 92.69,72.47 92.09,72.04 | 91.78,73.38 91.35,72.78 | 91.35,72.78 | 103.42,71.97 103.52,71.04 | 103.52,71.04 | 103.42,71.97 | 90.86,75.01 91.47,74.58 | 91.47,74.58 | 91.78,75.92 | 91.78,75.92 92.21,75.32 | 90.86,75.01 | 90.86,75.01 91.47,75.44 | 91.78,75.92 91.35,75.32 | 91.35,75.32 | 91.78,74.1 91.35,74.7 | 90.86,77.55 91.47,77.12 | 91.47,77.12 | 90.86,77.55 | 90.86,77.55 91.47,77.98 | 91.78,76.64 91.35,77.24 | 90.15,75.01 89.55,74.58 | 90.15,77.55 89.55,77.98 | 90.15,77.55 | 90.15,77.55 89.55,77.98 | 89.55,77.98 | 90.15,77.55 | 90.15,77.55 89.55,77.98 | 89.55,77.98 | DEVEL.9 89.55,77.98 | 90.15,77.55 89.55,77.12 | 90.15,77.55 89.55,77.98 | DEVEL.9 89.55,77.98 | 90.15,77.55 89.55,77.12 | 89.55,77.12 | DEVEL.9 89.55,77.12 | 90.15,77.55 89.55,77.98 | DEVEL.9 89.55,77.98 | 90.15,77.55 89.55,77.12 | DEVEL.9 89.55,77.12 | 90.15,77.55 89.55,77.98 | 90.15,77.55 | 90.15,77.55 89.55,77.12 | DEVEL.9 89.55,77.12 | 90.15,77.55 89.55,77.98 | DEVEL.9 89.55,77.98 | 90.15,77.55 89.55,77.12
  Bottom 0.305: DEVEL.9 89.55,77.12 | 92.69,72.47 92.09,72.9 | 91.78,73.38 92.21,72.78 | 92.69,72.47 | 92.69,72.47 92.09,72.9 | 92.09,72.9 | 92.69,72.47 | 92.69,72.47 92.09,72.9 | 92.09,72.9 | DEVEL.6 92.09,72.9 | 92.69,72.47 92.09,72.04 | 91.78,73.38 91.35,72.78 | 91.78,73.38 92.21,72.78 | 92.21,72.78 | DEVEL.6 92.21,72.78 | 91.35,72.78 | 92.69,72.47 92.09,72.9 | DEVEL.6 92.09,72.9 | 92.69,72.47 92.09,72.04 | 92.09,72.04 | DEVEL.6 92.09,72.04 | 92.69,72.47 92.09,72.9 | DEVEL.6 92.09,72.9 | 92.69,72.47 92.09,72.04 | DEVEL.6 92.09,72.04 | 92.69,72.47 92.09,72.9 | 92.69,72.47 | 92.69,72.47 92.09,72.04 | DEVEL.6 92.09,72.04 | 92.69,72.47 92.09,72.9 | DEVEL.6 92.09,72.9 | 92.69,72.47 92.09,72.04 | DEVEL.6 92.09,72.04 | 91.78,73.38 | 91.78,73.38 91.35,72.78 | DEVEL.6 91.35,72.78 | 91.78,73.38 92.21,72.78 | 91.78,73.38 | 91.78,73.38 91.35,72.78 | DEVEL.6 91.35,72.78 | 91.78,73.38 92.21,72.78 | 92.21,72.78 | 91.78,73.38 91.35,72.78 | DEVEL.6 91.35,72.78 | 91.78,73.38 92.21,72.78 | DEVEL.6 92.21,72.78 | 91.78,73.38 91.35,72.78 | DEVEL.6 91.35,72.78 | 91.78,73.38 92.21,72.78 | DEVEL.6 92.21,72.78 | 103.42,71.97 103.52,71.04 | TOUCH2.P$2 103.52,71.04 | 103.42,71.97 104.35,71.86 | 104.35,71.86 | TOUCH2.P$2 104.35,71.86 | TOUCH2.P$2 103.65,71.55 104.19,72.32 104.82,71.62 TOUCH2.P$2 | 103.42,71.97 103.52,71.04 | TOUCH2.P$2 103.52,71.04 | 103.42,71.97 104.35,71.86 | TOUCH2.P$2 104.35,71.86 | 118.85,16.51 119.48,16.02 XMEGA-TEST2.1 | 118.85,16.51 119.5,16.98 XMEGA-TEST2.1 | 91.78,75.92 92.21,75.32 | 91.78,74.1 91.35,74.7 | 90.86,75.01 91.47,74.58 | 91.78,75.92 91.35,75.32 | 91.78,75.92 92.21,75.32 | 92.21,75.32 | DEVEL.8 92.21,75.32 | 91.35,75.32 | 91.78,74.1 | 91.78,74.1 92.21,74.7 | 92.21,74.7 | 91.78,74.1 | 91.78,74.1 92.21,74.7
  Bottom 0.305: 92.21,74.7 | DEVEL.8 92.21,74.7 | 91.78,74.1 91.35,74.7 | 90.86,75.01 91.47,74.58 | 90.86,75.01 91.47,75.44 | 91.47,75.44 | DEVEL.8 91.47,75.44 | 91.47,74.58 | 91.78,75.92 | 91.78,75.92 91.35,75.32 | DEVEL.8 91.35,75.32 | 91.78,75.92 92.21,75.32 | 91.78,75.92 | 91.78,75.92 91.35,75.32 | DEVEL.8 91.35,75.32 | 91.78,75.92 92.21,75.32 | 92.21,75.32 | 91.78,75.92 91.35,75.32 | DEVEL.8 91.35,75.32 | 91.78,75.92 92.21,75.32 | DEVEL.8 92.21,75.32 | 91.78,75.92 91.35,75.32 | DEVEL.8 91.35,75.32 | 91.78,75.92 92.21,75.32 | DEVEL.8 92.21,75.32 | 91.78,74.1 92.21,74.7 | DEVEL.8 92.21,74.7 | 91.78,74.1 91.35,74.7 | 91.35,74.7 | DEVEL.8 91.35,74.7 | 91.78,74.1 92.21,74.7 | DEVEL.8 92.21,74.7 | 91.78,74.1 91.35,74.7 | DEVEL.8 91.35,74.7 | 91.78,74.1 92.21,74.7 | 91.78,74.1 | 91.78,74.1 91.35,74.7 | DEVEL.8 91.35,74.7 | 91.78,74.1 92.21,74.7 | DEVEL.8 92.21,74.7 | 91.78,74.1 91.35,74.7 | DEVEL.8 91.35,74.7 | 90.86,75.01 | 90.86,75.01 91.47,74.58 | DEVEL.8 91.47,74.58 | 90.86,75.01 91.47,75.44 | 90.86,75.01 | 90.86,75.01 91.47,74.58 | DEVEL.8 91.47,74.58 | 90.86,75.01 91.47,75.44 | 91.47,75.44 | 90.86,75.01 91.47,74.58 | DEVEL.8 91.47,74.58 | 90.86,75.01 91.47,75.44 | DEVEL.8 91.47,75.44 | 90.86,75.01 91.47,74.58 | DEVEL.8 91.47,74.58 | 90.86,75.01 91.47,75.44 | DEVEL.8 91.47,75.44 | 90.86,77.55 91.47,77.12 | 91.78,76.64 91.35,77.24 | 90.86,77.55 91.47,77.12 | 90.86,77.55 91.47,77.98 | 91.47,77.98 | DEVEL.10 91.47,77.98 | 91.47,77.12 | 91.78,76.64 | 91.78,76.64 92.21,77.24 | 92.21,77.24 | 91.78,76.64 | 91.78,76.64 92.21,77.24 | 92.21,77.24 | DEVEL.10 92.21,77.24 | 91.78,76.64 91.35,77.24 | 90.86,77.55 | 90.86,77.55 91.47,77.12 | DEVEL.10 91.47,77.12 | 90.86,77.55 91.47,77.98 | 90.86,77.55 | 90.86,77.55 91.47,77.12 | DEVEL.10 91.47,77.12
  Bottom 0.305: 90.86,77.55 91.47,77.98 | 91.47,77.98 | 90.86,77.55 91.47,77.12 | DEVEL.10 91.47,77.12 | 90.86,77.55 91.47,77.98 | DEVEL.10 91.47,77.98 | 90.86,77.55 91.47,77.12 | DEVEL.10 91.47,77.12 | 90.86,77.55 91.47,77.98 | DEVEL.10 91.47,77.98 | 91.78,76.64 92.21,77.24 | DEVEL.10 92.21,77.24 | 91.78,76.64 91.35,77.24 | 91.35,77.24 | DEVEL.10 91.35,77.24 | 91.78,76.64 92.21,77.24 | DEVEL.10 92.21,77.24 | 91.78,76.64 91.35,77.24 | DEVEL.10 91.35,77.24 | 91.78,76.64 92.21,77.24 | 91.78,76.64 | 91.78,76.64 91.35,77.24 | DEVEL.10 91.35,77.24 | 91.78,76.64 92.21,77.24 | DEVEL.10 92.21,77.24 | 91.78,76.64 91.35,77.24 | DEVEL.10 91.35,77.24 | 90.15,75.01 89.55,75.44 | 90.15,75.01 | 90.15,75.01 89.55,75.44 | 89.55,75.44 | 90.15,75.01 | 90.15,75.01 89.55,75.44 | 89.55,75.44 | DEVEL.7 89.55,75.44 | 90.15,75.01 89.55,74.58 | 90.15,75.01 89.55,75.44 | DEVEL.7 89.55,75.44 | 90.15,75.01 89.55,74.58 | 89.55,74.58 | DEVEL.7 89.55,74.58 | 90.15,75.01 89.55,75.44 | DEVEL.7 89.55,75.44 | 90.15,75.01 89.55,74.58 | DEVEL.7 89.55,74.58 | 90.15,75.01 89.55,75.44 | 90.15,75.01 | 90.15,75.01 89.55,74.58 | DEVEL.7 89.55,74.58 | 90.15,75.01 89.55,75.44 | DEVEL.7 89.55,75.44 | 90.15,75.01 89.55,74.58 | DEVEL.7 89.55,74.58
  Bottom 0.406: 71.88,29.21 72.52,29.84 79.53,29.84 80.78,31.09 | 71.88,29.21 v71.25,28.57 | 80.78,31.09 v81.42,31.73 | 71.88,29.21 71.13,28.79 v71.25,28.57 | 71.88,29.21 71.46,28.45 v71.25,28.57 | 80.78,31.09 81.54,31.51 v81.42,31.73 | 80.78,31.09 81.2,31.85 v81.42,31.73
  Bottom 0.508: 29.08,49.97 | 28.32,49.53 | 28.32,49.53 | 28.32,49.53 | 29.08,49.09 | 29.08,49.09 | 28.32,49.53 29.08,49.09 | MOTORDRIVER.11 29.08,49.09 | 28.32,49.53 29.08,49.97 | 29.08,49.97 | 29.08,49.97 | MOTORDRIVER.11 29.08,49.97 | 28.32,49.53 29.08,49.09 | 29.08,49.09 | 29.08,49.09 | 28.32,49.53 | 28.32,49.53 29.08,49.09 | MOTORDRIVER.11 29.08,49.09 | 28.32,49.53 29.08,49.97 | 29.08,49.97 | MOTORDRIVER.11 29.08,49.97 | 28.32,49.53 | 28.32,49.53 29.08,49.09 | MOTORDRIVER.11 29.08,49.09 | 28.32,49.53 29.08,49.97 | MOTORDRIVER.11 29.08,49.97 | 28.32,49.53 29.08,49.09 | 28.32,49.53 29.08,49.97 | 28.32,49.53 29.08,49.09 | MOTORDRIVER.11 29.08,49.09 | 28.32,49.53 29.08,49.97 | MOTORDRIVER.11 29.08,49.97 | 91.39,36.59 92.04,37.18 LCD-I2C.1 91.2,37.45 91.39,36.59
  Bottom 0.61: 120.75,24.22 120.09,24.22 120.09,24.4 XMEGA-TEST1.1 | 120.75,24.22 120.77,24.22 121.84,23.15 121.84,17.65 120.84,16.64 | 120.84,16.64 120.74,16.55 119.91,16.55 XMEGA-TEST2.1 | v60.66,70.99 60.34,70.99 59.56,70.2 | 59.56,70.2 56.12,66.77 | 56.12,66.77 55.56,66.2 55.08,66.2 v54.96,66.08 | 59.56,70.2 60.79,70.64 v60.66,70.99 | 59.56,70.2 60.37,71.22 v60.66,70.99 | 56.12,66.77 54.87,66.44 v54.96,66.08 | 56.12,66.77 55.23,65.83 v54.96,66.08 | 120.75,24.22 120.2,24.92 XMEGA-TEST1.1 | 120.75,24.22 119.85,24.2 XMEGA-TEST1.1 | 120.84,16.64 | 120.84,16.64 119.98,16.91 | XMEGA-TEST2.1 119.98,16.91 | 120.84,16.64 | 120.84,16.64 120.1,16.12 | XMEGA-TEST2.1 120.1,16.12 | 120.84,16.64 119.98,16.91 | 120.84,16.64 120.1,16.12 | 120.84,16.64 119.98,16.91 | XMEGA-TEST2.1 119.98,16.91 | 120.84,16.64 120.1,16.12 | XMEGA-TEST2.1 120.1,16.12
  Bottom 0.813: SERMO1.P$2 59.21,72.42 60.5,71.13 60.52,71.13 v60.66,70.99
  Bottom 1.016: 3.3C6.+ 59.18,89.72 59.21,89.69 SERMO1.P$2
+5V  (via drill 0.6, 0.7)
  Top 0.406: FAN-VCC.1 62.19,85.39 62.19,82.55
  Top 0.61: 5C16.+ 30.2,93.17 | 30.2,93.17 | 30.2,93.17 30.2,88.92 POWER-LEDR.2 | 30.2,93.17 29.8,93.68 | 30.2,93.17 | 30.2,93.17 30.59,93.68 | 30.2,93.17 | 30.2,93.17 29.8,93.68 | 29.8,93.68 | 30.2,93.17 30.59,93.68 | 30.2,93.17 29.8,93.68 | 5C16.+ 29.8,93.68 | 30.2,93.17 30.59,93.68 | 30.59,93.68 | 30.2,93.17 30.59,93.68 | 5C16.+ 30.59,93.68 | 30.2,93.17 29.8,93.68 | 29.8,93.68 | 29.8,93.68 | 5C16.+ 29.8,93.68 | 30.2,93.17 30.59,93.68 | 30.2,93.17 29.8,93.68 | 30.2,93.17 30.59,93.68 | 5C16.+ 30.59,93.68 | 30.2,93.17 | 30.2,93.17 29.8,93.68 | 5C16.+ 29.8,93.68 | 30.2,93.17 30.59,93.68 | 5C16.+ 30.59,93.68 | 30.2,93.17 29.8,93.68 | 5C16.+ 29.8,93.68
  Top 0.813: v35.05,80.64 36.96,82.55 62.19,82.55 69.98,82.55 72.48,80.04 SV8.2 | SV4.2 94.11,85.72 94.74,86.36 105.54,86.36 106.81,85.09 SV2.2 | 5C16.+ 30.61,93.98 v33.78,90.81 | CN2.P$7 120.5,51.81 115.41,56.91 112.99,56.91 SV1.2
  Top 1.016: SV7.2 106.81,3.88 106,3.07 74.83,3.07 73.77,4.12 73.77,5.7 SV6.2
  Top 1.676: 5V-REGU.OUT 39.41,94.3 5C14.1 5C15.1 33.69,93.98 5C16.+
  Bottom 0.813: RO2.P$2 20.27,67.94 | 30.61,93.98 5C16.+ | RO2.P$2 19.98,67.94 18.54,67.94 17.27,66.67 17.27,56.52 18.99,54.8 RO1.P$2 19.94,54.61 19.18,54.61 17.27,52.7 17.27,48.9 13.08,44.71 SV5.2 | RO2.P$2 23.48,67.8 26.16,70.48 26.16,76.83 28.07,78.74 33.15,78.74 v35.05,80.64 35.05,89.53 v33.78,90.81 | SV4.2 94.11,85.72 93.47,86.36 84.58,86.36 72.48,74.26 SV8.2 | SV2.2 106.81,81.92 115.7,73.03 115.7,58.42 114.22,56.94 SV1.2 | CN2.P$7 125.32,51.81 127.43,49.7 127.43,29.28 125.17,27.02 118.29,27.02 106.81,15.54 SV7.2
+9V  (via drill 0.6)
  Top 0.61: MOTORDRIVER.12 30.28,46.99 30.35,46.92 | 30.35,46.92 39.71,37.56 | 39.71,37.56 v40.34,36.92 | 39.71,37.56 40.22,36.84 v40.34,36.92 | 39.71,37.56 40.43,37.05 v40.34,36.92 | 30.35,46.92 29.57,47.38 MOTORDRIVER.12 | 30.35,46.92 29.51,46.57 MOTORDRIVER.12
  Top 1.676: 3.3C1.+ 88.53,94.3 3.3C2.1 3.3C3.1 79.64,94.3 3.3V-REGU.IN | 5C11.+ 56.55,94.3 5C12.1 5C13.1 46.39,94.3 5V-REGU.IN
  Top 1.778: 56.64,88.27 87.12,88.27 88.85,89.99 3.3C1.+ | 56.64,88.27 56.87,88.49 5C11.+ | 56.64,88.27 34.42,88.27 31.24,85.09 20.45,85.09 19.18,83.82 14.73,83.82 13.46,82.55 Q3.D
  Bottom 0.305: MOTORDRIVER.12 28.32,46.99 | 28.32,46.99 | 28.32,46.99 | 28.32,46.99 28.97,47.48 | 28.32,46.99 28.97,46.5 | 28.32,46.99 28.97,46.5 | 28.97,46.5 | 28.32,46.99 28.97,47.48 | 28.97,46.5 | 28.32,46.99 28.97,46.5 | 28.32,46.99 28.97,47.48 | 28.97,47.48 | MOTORDRIVER.12 28.97,47.48 | 28.32,46.99 | 28.32,46.99 28.97,46.5 | MOTORDRIVER.12 28.97,46.5 | 28.32,46.99 28.97,47.48 | 28.32,46.99 | 28.32,46.99 28.97,46.5 | MOTORDRIVER.12 28.97,46.5 | 28.32,46.99 28.97,47.48 | MOTORDRIVER.12 28.97,47.48 | 28.32,46.99 28.97,47.48 | 28.97,47.48 | 28.32,46.99 28.97,46.5 | MOTORDRIVER.12 28.97,46.5 | 28.32,46.99 28.97,47.48 | MOTORDRIVER.12 28.97,47.48 | 28.32,46.99 28.97,46.5 | MOTORDRIVER.12 28.97,46.5 | 28.32,46.99 28.97,47.48 | MOTORDRIVER.12 28.97,47.48
  Bottom 0.406: MAIN-LED.P$1 53.01,20.76
  Bottom 0.61: 28.32,46.99 24.26,46.99 15.37,38.1 15.37,31.11 13.46,29.21 9.56,29.21 8.21,30.56 8.21,32.56 7.75,33.02 | v40.34,36.92 40.34,36.02 | 40.34,36.02 40.34,30.52 42.2,28.67 42.2,20.77 45.83,17.14 49.1,17.14 52.16,20.2 | 52.16,20.2 MAIN-LED.P$1 | 53.01,20.76 53.7,20.07 | 53.7,20.07 57.31,16.46 85.2,16.46 98.58,29.84 102.96,29.84 | 102.96,29.84 VOLTAGE-METER.P$1 | 40.34,36.02 40.49,36.9 v40.34,36.92 | 40.34,36.02 40.2,36.9 v40.34,36.92 | 52.16,20.2 53.16,20.48 MAIN-LED.P$1 | 52.16,20.2 52.43,21.21 MAIN-LED.P$1 | 53.7,20.07 53.6,21.11 MAIN-LED.P$1 | 53.7,20.07 52.76,20.51 MAIN-LED.P$1 | 102.96,29.84 103.87,29.33 VOLTAGE-METER.P$1 | 102.96,29.84 103.87,30.36 VOLTAGE-METER.P$1
  Bottom 1.422: MOTOR-SW.2 6.83,32.1 7.75,33.02 7.75,38.1 2.67,43.18 2.67,73.03 5.21,75.56 12.19,75.56 13.46,76.83 Q3.D
CK
  Top 0.254: CN2.P$5 122.62,56.89 | 122.62,56.89 | 122.62,56.89 119.13,56.89 114.83,61.19 U1.66
  Top 0.508: 122.62,56.89 123.48,57.44 | 122.62,56.89 | 122.62,56.89 123.48,57.44 | 122.62,56.89 123.48,56.35 | 122.62,56.89 123.48,56.35 | 123.48,56.35 | 122.62,56.89 123.48,57.44 | 123.48,56.35 | 122.62,56.89 123.48,56.35 | 122.62,56.89 123.48,57.44 | 123.48,57.44 | CN2.P$5 123.48,57.44 | 122.62,56.89 | 122.62,56.89 123.48,56.35 | CN2.P$5 123.48,56.35 | 122.62,56.89 123.48,57.44 | 122.62,56.89 | 122.62,56.89 123.48,56.35 | CN2.P$5 123.48,56.35 | 122.62,56.89 123.48,57.44 | CN2.P$5 123.48,57.44 | 122.62,56.89 123.48,57.44 | 123.48,57.44 | 122.62,56.89 123.48,56.35 | CN2.P$5 123.48,56.35 | 122.62,56.89 123.48,57.44 | CN2.P$5 123.48,57.44 | 122.62,56.89 123.48,56.35 | CN2.P$5 123.48,56.35 | 122.62,56.89 123.48,57.44 | CN2.P$5 123.48,57.44
DEVEL1
  Top 0.254: DEVEL.1 89.11,67.39 88.53,66.81 85.91,64.19 U1.72
  Top 0.305: DEVEL-R1.2 88.33,67.28 | 88.33,67.28 89.13,67.28 DEVEL.1 | 88.33,67.28 88.98,66.92 DEVEL.1 | 88.33,67.28 88.88,67.78 DEVEL.1
  Top 0.508: 88.53,66.81 | 88.53,66.81 89.32,66.97 | 88.53,66.81 89.32,66.97 | DEVEL.1 89.32,66.97 | 88.53,66.81 88.84,67.56 | 88.53,66.81 89.32,66.97 | DEVEL.1 89.32,66.97 | 88.53,66.81 88.84,67.56 | DEVEL.1 88.84,67.56
  Bottom 0.305: DEVEL.5 89.24,71.56 | 89.24,71.56 | 89.24,71.56 89.24,70.84 | 89.24,70.84 | 89.24,70.84 DEVEL.3 | DEVEL.3 89.24,69.02 | 89.24,69.02 | 89.24,69.02 89.24,68.3 | 89.24,68.3 | 89.24,68.3 DEVEL.1 | 89.24,68.3 88.81,67.7 | 89.24,70.84 88.81,70.24 | 89.24,71.56 88.81,72.16 | 89.24,68.3 | 89.24,68.3 89.67,67.7 | 89.24,68.3 88.81,67.7 | 88.81,67.7 | 89.24,70.84 | 89.24,70.84 89.67,70.24 | 89.24,70.84 88.81,70.24 | 88.81,70.24 | 89.24,69.02 88.81,69.62 | 89.24,71.56 88.81,72.16 | 89.24,71.56 | 89.24,71.56 89.67,72.16 | 89.67,72.16 | 89.24,71.56 | 89.24,71.56 89.67,72.16 | 89.67,72.16 | DEVEL.5 89.67,72.16 | 89.24,71.56 88.81,72.16 | 89.24,71.56 89.67,72.16 | DEVEL.5 89.67,72.16 | 89.24,71.56 88.81,72.16 | 88.81,72.16 | DEVEL.5 88.81,72.16 | 89.24,71.56 89.67,72.16 | DEVEL.5 89.67,72.16 | 89.24,71.56 88.81,72.16 | DEVEL.5 88.81,72.16 | 89.24,71.56 89.67,72.16 | 89.24,71.56 | 89.24,71.56 88.81,72.16 | DEVEL.5 88.81,72.16 | 89.24,71.56 89.67,72.16 | DEVEL.5 89.67,72.16 | 89.24,71.56 88.81,72.16 | DEVEL.5 88.81,72.16 | 89.24,68.3 89.67,67.7 | 89.24,68.3 88.81,67.7 | 89.24,68.3 89.67,67.7 | 89.67,67.7 | DEVEL.1 89.67,67.7 | 88.81,67.7 | 89.24,68.3 | 89.24,68.3 88.81,67.7 | DEVEL.1 88.81,67.7 | 89.24,68.3 89.67,67.7 | 89.24,68.3 | 89.24,68.3 88.81,67.7 | DEVEL.1 88.81,67.7 | 89.24,68.3 89.67,67.7 | 89.67,67.7 | 89.24,68.3 88.81,67.7 | DEVEL.1 88.81,67.7 | 89.24,68.3 89.67,67.7 | DEVEL.1 89.67,67.7 | 89.24,68.3 88.81,67.7 | DEVEL.1 88.81,67.7 | 89.24,68.3 89.67,67.7 | DEVEL.1 89.67,67.7 | 89.24,70.84 89.67,70.24 | 89.24,69.02 88.81,69.62 | 89.24,70.84 88.81,70.24 | 89.24,70.84 89.67,70.24 | 89.67,70.24 | DEVEL.3 89.67,70.24 | 88.81,70.24 | 89.24,69.02 | 89.24,69.02 89.67,69.62 | 89.67,69.62 | 89.24,69.02 | 89.24,69.02 89.67,69.62 | 89.67,69.62
  Bottom 0.305: DEVEL.3 89.67,69.62 | 89.24,69.02 88.81,69.62 | 89.24,70.84 | 89.24,70.84 88.81,70.24 | DEVEL.3 88.81,70.24 | 89.24,70.84 89.67,70.24 | 89.24,70.84 | 89.24,70.84 88.81,70.24 | DEVEL.3 88.81,70.24 | 89.24,70.84 89.67,70.24 | 89.67,70.24 | 89.24,70.84 88.81,70.24 | DEVEL.3 88.81,70.24 | 89.24,70.84 89.67,70.24 | DEVEL.3 89.67,70.24 | 89.24,70.84 88.81,70.24 | DEVEL.3 88.81,70.24 | 89.24,70.84 89.67,70.24 | DEVEL.3 89.67,70.24 | 89.24,69.02 89.67,69.62 | DEVEL.3 89.67,69.62 | 89.24,69.02 88.81,69.62 | 88.81,69.62 | DEVEL.3 88.81,69.62 | 89.24,69.02 89.67,69.62 | DEVEL.3 89.67,69.62 | 89.24,69.02 88.81,69.62 | DEVEL.3 88.81,69.62 | 89.24,69.02 89.67,69.62 | 89.24,69.02 | 89.24,69.02 88.81,69.62 | DEVEL.3 88.81,69.62 | 89.24,69.02 89.67,69.62 | DEVEL.3 89.67,69.62 | 89.24,69.02 88.81,69.62 | DEVEL.3 88.81,69.62
DEVEL2
  Top 0.254: DEVEL-R2.2 97.28,67.58 97.28,69.22 96.57,69.93 92.69,69.93 DEVEL.4 | U1.71 88.08,63.69 91.13,66.74 DEVEL.2
  Top 0.508: 91.13,66.74 91.37,67.52 | 91.13,66.74 91.9,66.98 | 92.69,69.93 | 92.69,69.93 | 92.69,69.93 91.98,70.31 | 91.98,70.31 | DEVEL.4 91.98,70.31 | 92.69,69.93 91.98,69.55 | 91.13,66.74 | 91.13,66.74 91.9,66.98 | 91.13,66.74 | 91.13,66.74 91.37,67.52 | 91.13,66.74 91.9,66.98 | DEVEL.2 91.9,66.98 | 91.13,66.74 91.37,67.52 | DEVEL.2 91.37,67.52 | 91.13,66.74 91.9,66.98 | DEVEL.2 91.9,66.98 | 91.13,66.74 91.37,67.52 | DEVEL.2 91.37,67.52 | 92.69,69.93 91.98,70.31 | 91.98,70.31 | 91.98,69.55 | 92.69,69.93 91.98,70.31 | DEVEL.4 91.98,70.31 | 92.69,69.93 | 91.98,69.55 | DEVEL.4 91.98,69.55 | 92.69,69.93 91.98,70.31 | 92.69,69.93 | 92.69,69.93 91.98,69.55 | DEVEL.4 91.98,69.55 | 92.69,69.93 91.98,70.31 | DEVEL.4 91.98,70.31 | 92.69,69.93 91.98,69.55 | DEVEL.4 91.98,69.55
  Bottom 0.305: DEVEL.4 91.78,69.02 | 91.78,69.02 | 91.78,69.02 91.78,68.3 | 91.78,68.3 | 91.78,68.3 DEVEL.2 | 91.78,68.3 91.35,67.7 | 91.78,68.3 | 91.78,68.3 92.21,67.7 | 91.78,68.3 91.35,67.7 | 91.35,67.7 | 91.78,69.02 91.35,69.62 | 91.78,68.3 92.21,67.7 | 91.78,68.3 91.35,67.7 | 91.78,68.3 92.21,67.7 | 92.21,67.7 | DEVEL.2 92.21,67.7 | 91.35,67.7 | 91.78,68.3 | 91.78,68.3 91.35,67.7 | DEVEL.2 91.35,67.7 | 91.78,68.3 92.21,67.7 | 91.78,68.3 | 91.78,68.3 91.35,67.7 | DEVEL.2 91.35,67.7 | 91.78,68.3 92.21,67.7 | 92.21,67.7 | 91.78,68.3 91.35,67.7 | DEVEL.2 91.35,67.7 | 91.78,68.3 92.21,67.7 | DEVEL.2 92.21,67.7 | 91.78,68.3 91.35,67.7 | DEVEL.2 91.35,67.7 | 91.78,68.3 92.21,67.7 | DEVEL.2 92.21,67.7 | 91.78,69.02 91.35,69.62 | 91.78,69.02 | 91.78,69.02 92.21,69.62 | 92.21,69.62 | 91.78,69.02 | 91.78,69.02 92.21,69.62 | 92.21,69.62 | DEVEL.4 92.21,69.62 | 91.78,69.02 91.35,69.62 | 91.78,69.02 92.21,69.62 | DEVEL.4 92.21,69.62 | 91.78,69.02 91.35,69.62 | 91.35,69.62 | DEVEL.4 91.35,69.62 | 91.78,69.02 92.21,69.62 | DEVEL.4 92.21,69.62 | 91.78,69.02 91.35,69.62 | DEVEL.4 91.35,69.62 | 91.78,69.02 92.21,69.62 | 91.78,69.02 | 91.78,69.02 91.35,69.62 | DEVEL.4 91.35,69.62 | 91.78,69.02 92.21,69.62 | DEVEL.4 92.21,69.62 | 91.78,69.02 91.35,69.62 | DEVEL.4 91.35,69.62
DOUT
  Top 0.254: U1.68 122.64,62.19 123.61,62.19 CN2.P$3
  Top 0.508: 122.64,62.19 123.38,61.5 CN2.P$3 123.58,62.57 122.64,62.19
FT232-RXD  (via drill 0.5)
  Top 0.254: L1.A 39.56,15.18 38.86,15.88 32.97,15.88 28.17,20.68 IC5.5 | 28.14,22.7 IC5.5 | v27.7,24.56 28.17,24.09 28.17,23.98 | 28.17,23.98 IC5.5 | 28.17,23.98 27.96,24.64 v27.7,24.56 | 28.17,23.98 27.56,24.32 v27.7,24.56
  Bottom 0.254: 20.07,28.95 | 20.07,28.95 20.45,28.57 | 20.45,28.4 20.45,27.3 22.99,24.77 26.98,24.77 | 26.98,24.77 27.5,24.77 v27.7,24.56 | 26.98,24.77 27.53,24.34 v27.7,24.56 | 26.98,24.77 27.67,24.84 v27.7,24.56
  Bottom 0.305: S1.10 20.45,30.02 | 20.45,30.02 | 20.45,30.02 20.45,30.48 21.08,31.11 24.89,31.11 25.53,30.48 | S1.14 30.61,30.02 | 30.61,30.02 | 30.61,30.02 30.61,30.48 29.97,31.11 26.16,31.11 25.53,30.48 | 25.53,30.48 25.53,30.02 | 25.53,30.02 | 25.53,30.02 S1.12 | 20.45,28.4 20.45,28.57 S1.10 | 20.45,28.4 20.07,28.95 | S1.10 20.07,28.95 | 30.61,30.02 | 30.61,30.02 30.98,29.47 | 30.61,30.02 30.23,29.47 | 30.61,30.02 30.23,29.47 | S1.14 30.23,29.47 | 25.53,30.02 | 25.53,30.02 25.9,29.47 | 25.53,30.02 25.15,29.47 | 25.53,30.02 25.15,29.47 | S1.12 25.15,29.47 | 20.45,30.02 | 20.45,30.02 20.82,29.47 | 20.45,30.02 20.07,29.47 | 20.45,30.02 20.07,29.47 | S1.10 20.07,29.47 | 30.61,30.02 30.98,29.47 | 30.61,30.02 30.23,29.47 | 30.61,30.02 30.23,29.47 | 30.61,30.02 30.98,29.47 | S1.14 30.98,29.47 | 30.23,29.47 | 30.23,29.47 | 30.61,30.02 | 30.61,30.02 30.23,29.47 | S1.14 30.23,29.47 | 30.61,30.02 30.98,29.47 | 30.61,30.02 | 30.61,30.02 30.23,29.47 | S1.14 30.23,29.47 | 30.61,30.02 30.98,29.47 | S1.14 30.98,29.47 | 30.61,30.02 30.23,29.47 | 30.61,30.02 30.98,29.47 | 30.61,30.02 30.23,29.47 | S1.14 30.23,29.47 | 30.61,30.02 30.98,29.47 | S1.14 30.98,29.47 | 25.53,30.02 25.9,29.47 | 25.53,30.02 25.15,29.47 | 25.53,30.02 25.15,29.47 | 25.53,30.02 25.9,29.47 | S1.12 25.9,29.47 | 25.15,29.47 | 25.15,29.47 | 25.53,30.02 | 25.53,30.02 25.15,29.47 | S1.12 25.15,29.47 | 25.53,30.02 25.9,29.47 | 25.53,30.02 | 25.53,30.02 25.15,29.47 | S1.12 25.15,29.47 | 25.53,30.02 25.9,29.47 | S1.12 25.9,29.47 | 25.53,30.02 25.15,29.47 | 25.53,30.02 25.9,29.47 | 25.53,30.02 25.15,29.47 | S1.12 25.15,29.47 | 25.53,30.02 25.9,29.47 | S1.12 25.9,29.47 | 20.45,30.02 20.82,29.47 | 20.45,30.02 20.07,29.47 | 20.45,30.02 20.07,29.47 | 20.45,30.02 20.82,29.47
  Bottom 0.305: S1.10 20.82,29.47 | 20.45,28.4 20.82,28.95 | S1.10 20.82,28.95 | 20.45,28.4 20.07,28.95 | 20.45,28.4 20.07,28.95 | 20.07,29.47 | 20.07,29.47 | 20.45,30.02 | 20.45,30.02 20.07,29.47 | S1.10 20.07,29.47 | 20.45,30.02 20.82,29.47 | 20.45,30.02 | 20.45,30.02 20.07,29.47 | S1.10 20.07,29.47 | 20.45,30.02 20.82,29.47 | S1.10 20.82,29.47 | 20.45,30.02 20.07,29.47 | 20.45,30.02 20.82,29.47 | 20.45,30.02 20.07,29.47 | S1.10 20.07,29.47 | 20.45,30.02 20.82,29.47 | S1.10 20.82,29.47 | 20.45,28.4 | 20.45,28.4 20.82,28.95 | 20.45,28.4 20.07,28.95 | 20.07,28.95 | 20.45,28.4 20.82,28.95 | S1.10 20.82,28.95 | 20.45,28.4 20.07,28.95 | S1.10 20.07,28.95 | 20.45,28.4 20.82,28.95 | 20.45,28.4 20.07,28.95 | S1.10 20.07,28.95 | 20.45,28.4 20.82,28.95 | S1.10 20.82,28.95 | 20.45,28.4 20.07,28.95 | S1.10 20.07,28.95
  Bottom 0.508: 20.13,29.05 | S1.10 20.13,29.05 | 20.45,28.4 | 20.45,28.4 20.77,29.05 | 20.77,29.05 | 20.45,28.4 | 20.45,28.4 20.77,29.05 | S1.10 20.77,29.05 | 20.45,28.4 | 20.45,28.4 20.13,29.05 | 20.13,29.05 | 20.45,28.4 | 20.45,28.4 20.13,29.05 | S1.10 20.13,29.05 | 20.45,28.4 20.13,29.05 | 20.13,29.05 | 20.45,28.4 20.77,29.05 | 20.77,29.05 | S1.10 20.77,29.05 | 20.45,28.4 20.13,29.05 | S1.10 20.13,29.05 | 20.45,28.4 20.77,29.05 | S1.10 20.77,29.05 | 20.45,28.4 20.13,29.05 | S1.10 20.13,29.05
FT232-TXD  (via drill 0.5)
  Top 0.254: 31.24,23.38 31.24,23.15 IC5.1 30.77,19.52 33.78,16.51 40.13,16.51 42.74,13.91 L2.A | 31.24,23.38 v31.24,24.13 | 17.91,29.84 S1.9 17.91,30.02 17.91,30.48 18.54,31.11 22.35,31.11 22.99,30.48 | 22.99,30.48 22.99,30.02 S1.11 | 22.99,30.48 23.62,31.11 27.43,31.11 28.07,30.48 28.07,30.02 S1.13 | 31.5,24.03 | 30.99,24.03 | 31.24,23.38 31.5,24.03 | 31.24,23.38 | 31.24,23.38 30.99,24.03 | 31.24,23.38 31.5,24.03 | v31.24,24.13 31.5,24.03 | 31.24,23.38 30.99,24.03 | v31.24,24.13 30.99,24.03 | 31.24,23.38 31.5,24.03 | 31.24,23.38 30.99,24.03 | 31.24,23.38 31.5,24.03 | v31.24,24.13 31.5,24.03 | 31.24,23.38 30.99,24.03 | v31.24,24.13 30.99,24.03
  Top 0.508: 17.59,29.37 | 17.59,29.37 | S1.9 17.59,29.37 | 22.67,29.37 | 22.67,29.37 | S1.11 22.67,29.37 | 27.75,29.37 | 27.75,29.37 | S1.13 27.75,29.37 | 17.91,30.02 | 17.91,30.02 17.59,29.37 | 17.91,30.02 18.23,29.37 | 18.23,29.37 | S1.9 18.23,29.37 | 22.99,30.02 | 22.99,30.02 22.67,29.37 | 22.99,30.02 23.31,29.37 | 23.31,29.37 | S1.11 23.31,29.37 | 28.07,30.02 | 28.07,30.02 27.75,29.37 | 28.07,30.02 28.39,29.37 | 28.39,29.37 | S1.13 28.39,29.37 | 17.91,30.02 17.59,29.37 | 17.91,30.02 18.23,29.37 | 17.59,29.37 | 17.59,29.37 | 17.91,30.02 | 17.91,30.02 17.59,29.37 | S1.9 17.59,29.37 | 17.91,30.02 18.23,29.37 | 18.23,29.37 | 17.91,30.02 | 17.91,30.02 17.59,29.37 | S1.9 17.59,29.37 | 17.91,30.02 | 17.91,30.02 18.23,29.37 | S1.9 18.23,29.37 | 17.91,30.02 17.59,29.37 | 17.91,30.02 18.23,29.37 | 17.91,30.02 17.59,29.37 | S1.9 17.59,29.37 | 17.91,30.02 18.23,29.37 | S1.9 18.23,29.37 | 22.99,30.02 22.67,29.37 | 22.99,30.02 23.31,29.37 | 22.67,29.37 | 22.67,29.37 | 22.99,30.02 | 22.99,30.02 22.67,29.37 | S1.11 22.67,29.37 | 22.99,30.02 23.31,29.37 | 23.31,29.37 | 22.99,30.02 | 22.99,30.02 22.67,29.37 | S1.11 22.67,29.37 | 22.99,30.02 | 22.99,30.02 23.31,29.37 | S1.11 23.31,29.37 | 22.99,30.02 22.67,29.37 | 22.99,30.02 23.31,29.37 | 22.99,30.02 22.67,29.37 | S1.11 22.67,29.37 | 22.99,30.02 23.31,29.37 | S1.11 23.31,29.37 | 28.07,30.02 27.75,29.37 | 28.07,30.02 28.39,29.37 | 27.75,29.37 | 27.75,29.37 | 28.07,30.02 | 28.07,30.02 27.75,29.37 | S1.13 27.75,29.37 | 28.07,30.02 28.39,29.37 | 28.39,29.37 | 28.07,30.02 | 28.07,30.02 27.75,29.37 | S1.13 27.75,29.37 | 28.07,30.02 | 28.07,30.02 28.39,29.37 | S1.13 28.39,29.37 | 28.07,30.02 27.75,29.37 | 28.07,30.02 28.39,29.37 | 28.07,30.02 27.75,29.37 | S1.13 27.75,29.37 | 28.07,30.02 28.39,29.37 | S1.13 28.39,29.37
  Bottom 0.254: v31.24,24.13 30.71,24.66 | 30.71,24.66 28.07,27.3 28.07,28.4 S1.13 | 30.71,24.66 30.99,24.02 v31.24,24.13 | 30.71,24.66 31.35,24.38 v31.24,24.13
  Bottom 0.508: 27.75,29.05 | S1.13 27.75,29.05 | 28.07,28.4 | 28.07,28.4 | 28.07,28.4 28.39,29.05 | 28.39,29.05 | S1.13 28.39,29.05 | 28.07,28.4 27.75,29.05 | 28.07,28.4 28.39,29.05 | 28.39,29.05 | 27.75,29.05 | 28.07,28.4 28.39,29.05 | S1.13 28.39,29.05 | 28.07,28.4 | 27.75,29.05 | S1.13 27.75,29.05 | 28.07,28.4 28.39,29.05 | 28.07,28.4 | 28.07,28.4 27.75,29.05 | S1.13 27.75,29.05 | 28.07,28.4 28.39,29.05 | S1.13 28.39,29.05 | 28.07,28.4 27.75,29.05 | S1.13 27.75,29.05
FT-POWERLED
  Top 0.254: FT-POWERLED.C 17.91,23.53 FT232-R3.2
FT-RESET  (via drill 0.5)  (1 unrouted)
  Top 0.254: 27.52,19.73 27.52,19.4 v27.86,19.06 | 27.52,19.73 IC5.6 | S1.15 33.96,29.21 34.87,29.21 S1.16 36.26,28.64 36.89,28.01 56.89,28.01 | 74.35,62.94 v74.35,62.74 | 73.81,63.27 70.6,66.49 U1.90 70.6,69.36 72.03,70.79 74.59,70.79 76.99,73.18 76.99,74.02 77.6,74.64 X-R1.1 | 73.81,63.27 v74.35,62.74 | SV3.5 123.96,84.3 115.65,92.61 111.36,92.61 RESET-XMEGA.1 109.36,92.61 104.86,92.61 RESET-XMEGA.2 102.86,92.61 96.46,92.61 X-R1.1 | X-R1.1 78.44,74.64 78.21,74.41 | 56.89,28.01 v57.64,28.01 | 27.52,19.73 27.58,19.03 v27.86,19.06 | 27.52,19.73 28.04,19.26 v27.86,19.06 | 73.81,63.27 74.09,62.63 v74.35,62.74 | 73.81,63.27 74.45,62.99 v74.35,62.74 | 56.89,28.01 57.54,27.75 v57.64,28.01 | 56.89,28.01 57.54,28.27 v57.64,28.01
  Top 0.508: 33.3,28.89 | S1.15 33.3,28.89 | 35.53,28.89 | 35.53,28.89 | S1.16 35.53,28.89 | 33.96,29.21 | 33.96,29.21 | 33.96,29.21 33.3,29.53 | 33.3,29.53 | S1.15 33.3,29.53 | 33.96,29.21 33.3,28.89 | 34.87,29.21 | 34.87,29.21 35.53,28.89 | 34.87,29.21 35.53,29.53 | 35.53,29.53 | S1.16 35.53,29.53 | 33.96,29.21 33.3,29.53 | 33.3,29.53 | 33.3,28.89 | 33.96,29.21 33.3,29.53 | S1.15 33.3,29.53 | 33.96,29.21 | 33.3,28.89 | S1.15 33.3,28.89 | 33.96,29.21 33.3,29.53 | 33.96,29.21 | 33.96,29.21 33.3,28.89 | S1.15 33.3,28.89 | 33.96,29.21 33.3,29.53 | S1.15 33.3,29.53 | 33.96,29.21 33.3,28.89 | S1.15 33.3,28.89 | 34.87,29.21 35.53,28.89 | 34.87,29.21 35.53,29.53 | 35.53,28.89 | 35.53,28.89 | 34.87,29.21 | 34.87,29.21 35.53,28.89 | S1.16 35.53,28.89 | 34.87,29.21 35.53,29.53 | 35.53,29.53 | 34.87,29.21 | 34.87,29.21 35.53,28.89 | S1.16 35.53,28.89 | 34.87,29.21 | 34.87,29.21 35.53,29.53 | S1.16 35.53,29.53 | 34.87,29.21 35.53,28.89 | 34.87,29.21 35.53,29.53 | 34.87,29.21 35.53,28.89 | S1.16 35.53,28.89 | 34.87,29.21 35.53,29.53 | S1.16 35.53,29.53 | S1.16 36.02,29.33 36.26,28.64 35.57,28.87 S1.16 | RESET-XMEGA.1 110.6,93.04 111.36,92.61 110.6,92.18 RESET-XMEGA.1 | RESET-XMEGA.1 110.11,92.18 109.36,92.61 110.11,93.04 RESET-XMEGA.1 | RESET-XMEGA.2 104.1,93.04 104.86,92.61 104.1,92.18 RESET-XMEGA.2 | RESET-XMEGA.2 103.61,92.18 102.86,92.61 103.61,93.04 RESET-XMEGA.2 | 123.96,84.3 124.19,83.53 SV3.5 124.73,84.06 123.96,84.3
  Bottom 0.254: 28.97,19.05 31.88,19.05 33.15,20.32 33.15,28.4 S1.15 | 28.97,19.05 | v27.86,19.06 28.61,19.06 | 28.61,19.06 28.96,19.06 28.97,19.05 | 78.87,35.56 78.87,52.7 74.35,57.23 74.35,61.99 | 78.87,35.56 80.77,33.66 87.76,33.66 89.16,35.05 89.16,36.54 LCD-I2C.2 | v74.35,62.74 74.35,61.99 | v57.64,28.01 58.17,28.54 | 58.17,28.54 61.73,32.1 75.41,32.1 78.87,35.56 | 28.61,19.06 27.96,19.31 v27.86,19.06 | 28.61,19.06 27.96,18.8 v27.86,19.06 | 74.35,61.99 74.6,62.64 v74.35,62.74 | 74.35,61.99 74.09,62.64 v74.35,62.74 | 58.17,28.54 57.53,28.26 v57.64,28.01 | 58.17,28.54 57.89,27.9 v57.64,28.01